# Altium schematic sheet eeprom.SchDoc
size A4
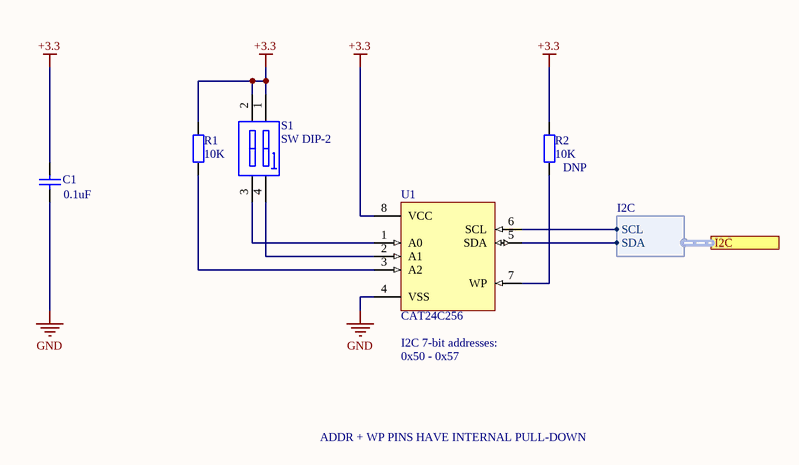
[diagram p0: eeprom.SchDoc]

## Parts
C1  value 0.1uF  [C0603]  (hidden comment: Cap)
R1  value 10K  [R0603]  (hidden comment: Res2)
R2  value 10K  Place: DNP  [R0603]  (hidden comment: Res2)
S1  SW DIP-2  [MCDHN-02F-V]
U1  CAT24C256  [CAT24C256-SOIC]

## Ports
I2C (harness I2C)

## Harnesses
I2C: SCL, SDA

## Nets
+3.3: C1.2 R1.2 R2.2 S1.1(A1) S1.2(A2) U1.8(VCC)
GND: C1.1 U1.4(VSS)
NetR1_1: R1.1 U1.3(A2)
NetR2_1: R2.1 U1.7(WP)
NetS1_3: S1.3(B2) U1.1(A0)
NetS1_4: S1.4(B1) U1.2(A1)
NetU1_5: U1.5(SDA) ; port I2C.SDA
NetU1_6: U1.6(SCL) ; port I2C.SCL

## Notes on the sheet
- (near U1) I2C 7-bit addresses:
- 0x50 - 0x57
- ADDR + WP PINS HAVE INTERNAL PULL-DOWN

## Library data of the parts
C1 = Cap: Capacitor; Published: 8-Jun-2000; LatestRevisionDate: 17-Jul-2002; LatestRevisionNote: Re-released for DXP Platform.; PackageReference: RAD-0.3; Publisher: Altium Limited; farnell: 1759122
R1 R2 = Res2: Resistor; Published: 8-Jun-2000; LatestRevisionDate: 17-Jul-2002; LatestRevisionNote: Re-released for DXP Platform.; PackageReference: AXIAL-0.4; Publisher: Altium Limited; farnell: 9330399
S1 = SW DIP-2: DIP Switch, 2 Position, SPST; Published: 24-Mar-1999; LatestRevisionDate: 17-Jul-2002; LatestRevisionNote: Re-released for DXP Platform.; PackageReference: DIP-4; Publisher: Altium Limited; farnell: 1605473
U1 = CAT24C256: CAT24C256 256 kb I2  C CMOS Serial  EEPROM; digikey: CAT24C256WI-GT3OSCT-ND